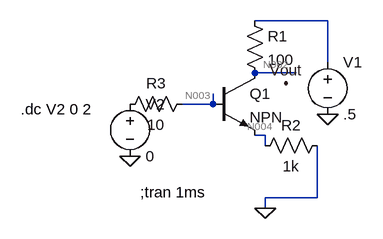
[diagram p0: schematic tut2 Q9.asc]
tut2 Q9.asc, the LTspice schematic file:
Version 4
SHEET 1 880 680
WIRE 272 32 160 32
WIRE 272 96 272 32
WIRE 224 112 160 112
WIRE 96 160 96 144
WIRE 96 160 48 160
WIRE 176 208 160 208
WIRE 176 224 176 208
WIRE 256 304 256 224
WIRE 256 304 176 304
WIRE 176 320 176 304
FLAG 272 176 0
FLAG 208 128 Vout
FLAG 176 320 0
FLAG -32 240 0
SYMBOL npn 96 112 R0
SYMATTR InstName Q1
SYMBOL voltage 272 80 R0
WINDOW 123 0 0 Left 2
WINDOW 39 0 0 Left 2
SYMATTR InstName V1
SYMATTR Value .5
SYMBOL res 144 16 R0
SYMATTR InstName R1
SYMATTR Value 100
SYMBOL res 272 208 R90
WINDOW 0 0 56 VBottom 2
WINDOW 3 32 56 VTop 2
SYMATTR InstName R2
SYMATTR Value 1k
SYMBOL res 64 144 R90
WINDOW 0 0 56 VBottom 2
WINDOW 3 32 56 VTop 2
SYMATTR InstName R3
SYMATTR Value 10
SYMBOL voltage -32 144 R0
WINDOW 123 0 0 Left 2
WINDOW 39 0 0 Left 2
SYMATTR InstName V2
SYMATTR Value 0
TEXT -16 296 Left 2 !;tran 1ms
TEXT -200 168 Left 2 !.dc V2 0 2

The netlist it stands for:
* tut2 Q9.asc
Q1 N002 N003 N004 0 NPN
V1 N001 0 .5
R1 N001 N002 100
R2 0 N004 1k
R3 N003 P001 10
V2 P001 0 0
.model NPN NPN
.model PNP PNP
.lib standard.bjt
;tran 1ms
.dc V2 0 2
.backanno
.end

* Results of the author's LTspice run, read from the files saved beside the schematic
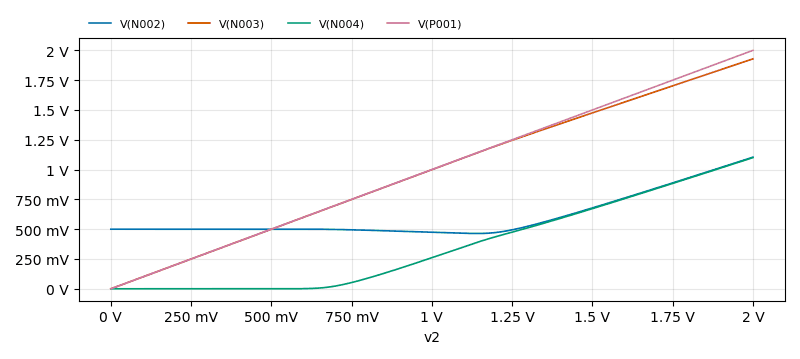
[diagram p1: DC transfer characteristic of tut2 Q9.asc, plotted from the saved traces]
* DC transfer characteristic, 1 run:
*   V(N002): 500 mV at v2=0 V, 1.104 V at v2=2 V, min 463.8 mV, max 1.104 V
*   V(N003): 5.001 pV at v2=0 V, 1.929 V at v2=2 V, min 5.001 pV, max 1.929 V
*   V(N004): 100 fV at v2=0 V, 1.1 V at v2=2 V, min 100 fV, max 1.1 V
*   V(P001): 0 V at v2=0 V, 2 V at v2=2 V, min 0 V, max 2 V